# EAGLE design Martin-V-USB_Mame_Panel_Atmega8ISP-V20f (EAGLE 6.3)
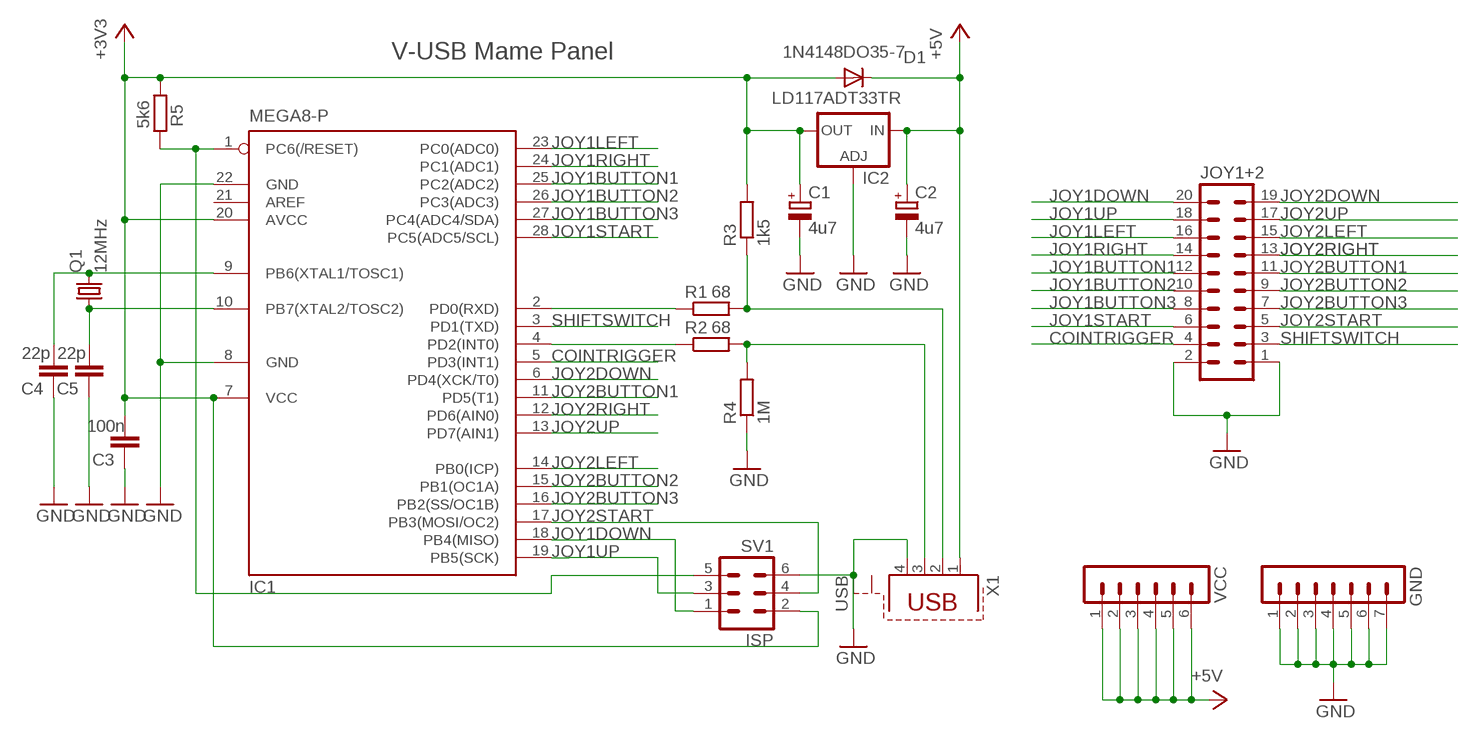
[diagram p0: schematic, sheet 1]

## Parts
C1  4u7  CPOL-EUE2.5-5  [E2,5-5]
C2  4u7  CPOL-EUE2.5-5  [E2,5-5]
C3  100n  C-EU050-030X075  [C050-030X075]
C4  22p  C-EU025-025X050  [C025-025X050]
C5  22p  C-EU025-025X050  [C025-025X050]
D1  1N4148DO35-7  [DO35-7]
GND  MA07-1  [MA07-1]
IC1  MEGA8-P  [DIL28-3]
IC2  LD117ADT33TR  [DPACK]
JOY1+2  MA10-2W  [MA10-2W]
Q1  12MHz  CRYSTALHC18U-V  [HC18U-V]
R1  68  R-EU_0207/10  [0207/10]
R2  68  R-EU_0207/10  [0207/10]
R3  1k5  R-EU_0207/10  [0207/10]
R4  1M  R-EU_0207/10  [0207/10]
R5  5k6  R-EU_0207/10  [0207/10]
SV1  ISP  ML6  [ML6]
VCC  MA06-1  [MA06-1]
X1  USB  PN61729-S  [PN61729-S]

## Nets
+3V3 [power]: C1.+ C3.2 D1.A IC1.7(VCC) IC1.20(AVCC) IC2.4(OUT) R3.2 R5.1 SV1.2
+5V [power]: C2.+ D1.C IC2.3(IN) VCC.1 VCC.2 VCC.3 VCC.4 VCC.5 VCC.6 X1.1
COINTRIGGER: IC1.5(PD3(INT1)) JOY1+2.4
GND [power]: C1.- C2.- C3.1 C4.1 C5.1 GND.1 GND.2 GND.3 GND.4 GND.5 GND.6 GND.7 IC1.8(GND) IC1.22(GND) IC2.1(ADJ) JOY1+2.1 JOY1+2.2 R4.1 SV1.6 X1.4
JOY1BUTTON1: IC1.25(PC2(ADC2)) JOY1+2.12
JOY1BUTTON2: IC1.26(PC3(ADC3)) JOY1+2.10
JOY1BUTTON3: IC1.27(PC4(ADC4/SDA)) JOY1+2.8
JOY1DOWN: IC1.18(PB4(MISO)) JOY1+2.20 SV1.1
JOY1LEFT: IC1.23(PC0(ADC0)) JOY1+2.16
JOY1RIGHT: IC1.24(PC1(ADC1)) JOY1+2.14
JOY1START: IC1.28(PC5(ADC5/SCL)) JOY1+2.6
JOY1UP: IC1.19(PB5(SCK)) JOY1+2.18 SV1.3
JOY2BUTTON1: IC1.11(PD5(T1)) JOY1+2.11
JOY2BUTTON2: IC1.15(PB1(OC1A)) JOY1+2.9
JOY2BUTTON3: IC1.16(PB2(SS/OC1B)) JOY1+2.7
JOY2DOWN: IC1.6(PD4(XCK/T0)) JOY1+2.19
JOY2LEFT: IC1.14(PB0(ICP)) JOY1+2.15
JOY2RIGHT: IC1.12(PD6(AIN0)) JOY1+2.13
JOY2START: IC1.17(PB3(MOSI/OC2)) JOY1+2.5 SV1.4
JOY2UP: IC1.13(PD7(AIN1)) JOY1+2.17
N$1: IC1.2(PD0(RXD)) R1.1
N$2: IC1.4(PD2(INT0)) R2.1
N$3: IC1.1(PC6(/RESET)) R5.2 SV1.5
N$4: R1.2 R3.1 X1.2
N$5: R2.2 R4.2 X1.3
N$10: C4.2 IC1.9(PB6(XTAL1/TOSC1)) Q1.2
N$11: C5.2 IC1.10(PB7(XTAL2/TOSC2)) Q1.1
SHIFTSWITCH: IC1.3(PD1(TXD)) JOY1+2.3
Unconnected: IC1.21(AREF) X1.S1 X1.S2

## Notes on the sheet
- V-USB Mame Panel

## Library data of the parts
C1 C2 = rcl:CPOL-EU: POLARIZED CAPACITOR, European symbol
C3-C5 = resistor:C-EU: CAPACITOR, European symbol
D1 = diode:1N4148: DIODE high speed (Philips)
GND = con-lstb:MA07-1: PIN HEADER; OC_FARNELL: unknown; OC_NEWARK: unknown
IC1 = atmel:MEGA8-P: MICROCONTROLLER 8 Kbytes FLASH, 1 kbytes SRAM, 512 bytes EEPROM, USART, 4-channel 10 bit ADC, 2-channel 8 bit ADC Pin compatible with Atmega48, ATMega88, ATMega168 Source: avr.lbr
IC2 = v-reg:LD117A?*: Low drop fixed and adjustable positive voltage regulators 1 A Source: http://www.st.com/stonline/products/literature/ds/7194/ld1117axx.pdf
JOY1+2 = con-lstb:MA10-2W: PIN HEADER; OC_FARNELL: unknown; OC_NEWARK: unknown
Q1 = crystal:CRYSTAL: CRYSTAL
R1 R3-R5 = resistor:R-EU_: RESISTOR, European symbol
R2 = rcl:R-EU_: RESISTOR, European symbol
SV1 = con-harting-ml:ML6: HARTING
VCC = con-lstb:MA06-1: PIN HEADER; OC_FARNELL: unknown; OC_NEWARK: unknown
X1 = con-berg:PN61729-S: BERG USB connector; OC_FARNELL: unknown; OC_NEWARK: unknown

## Net classes
0 default: width 0.254 mm
1 power: width 0.813 mm

## Board
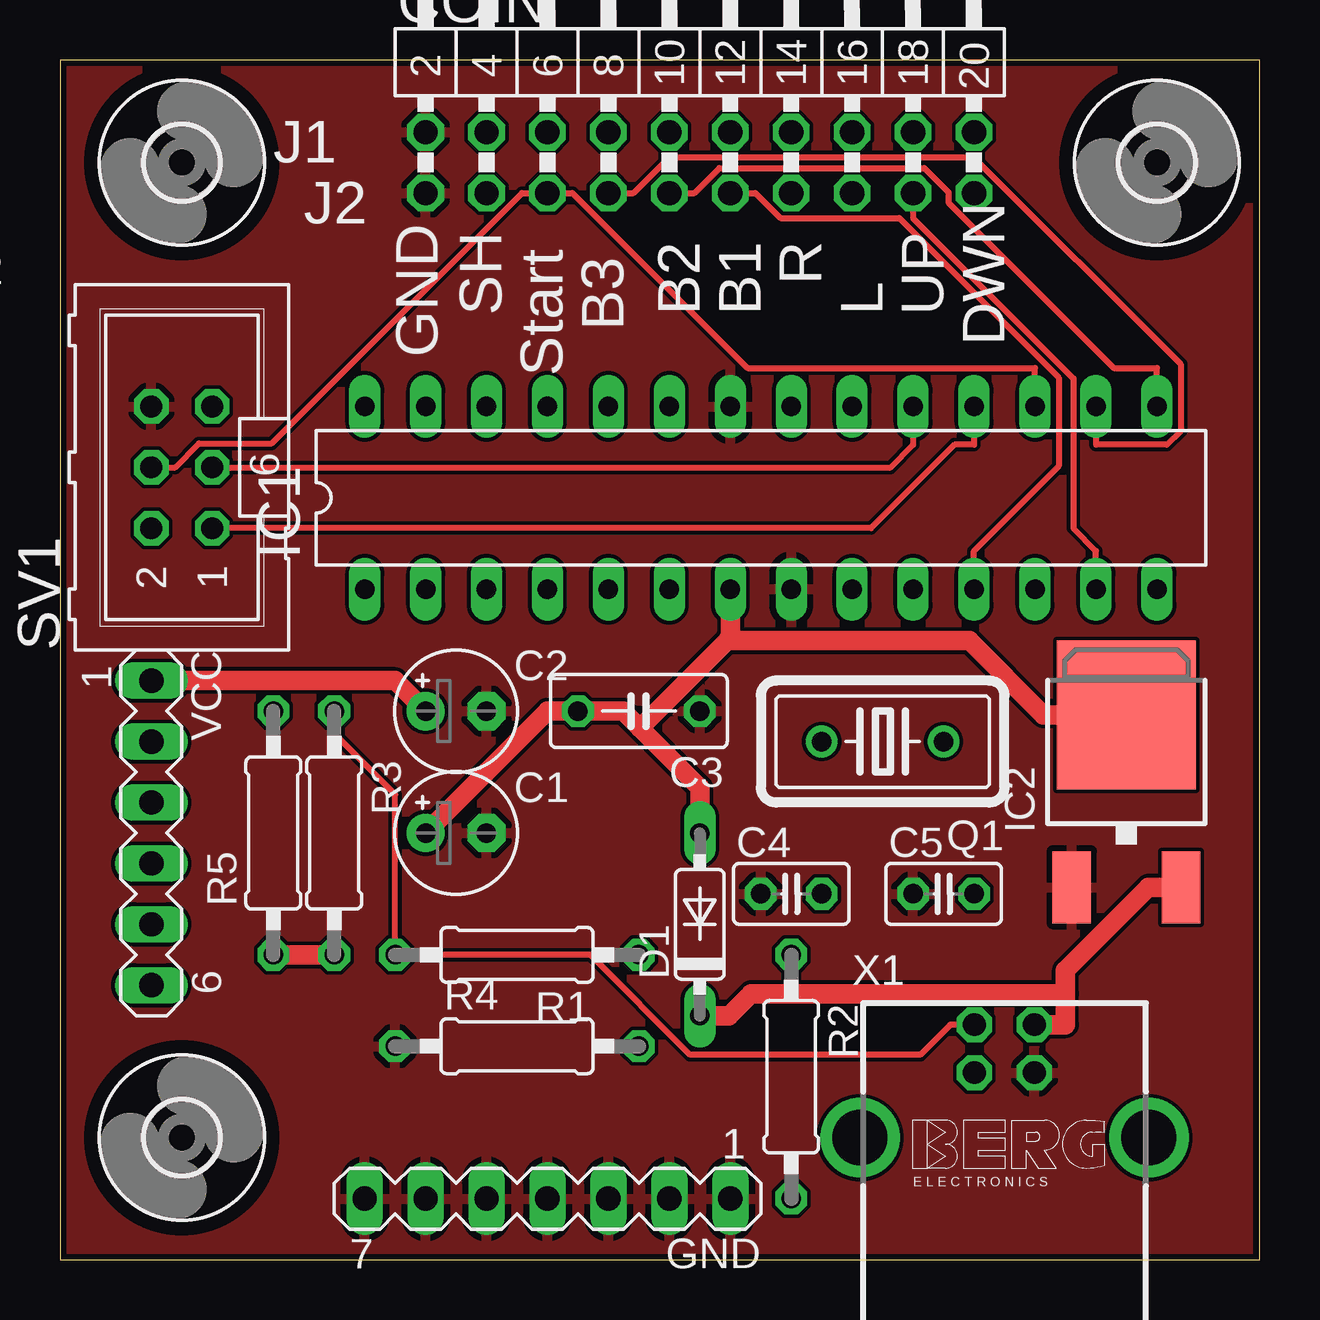
[diagram p1: board, top side]
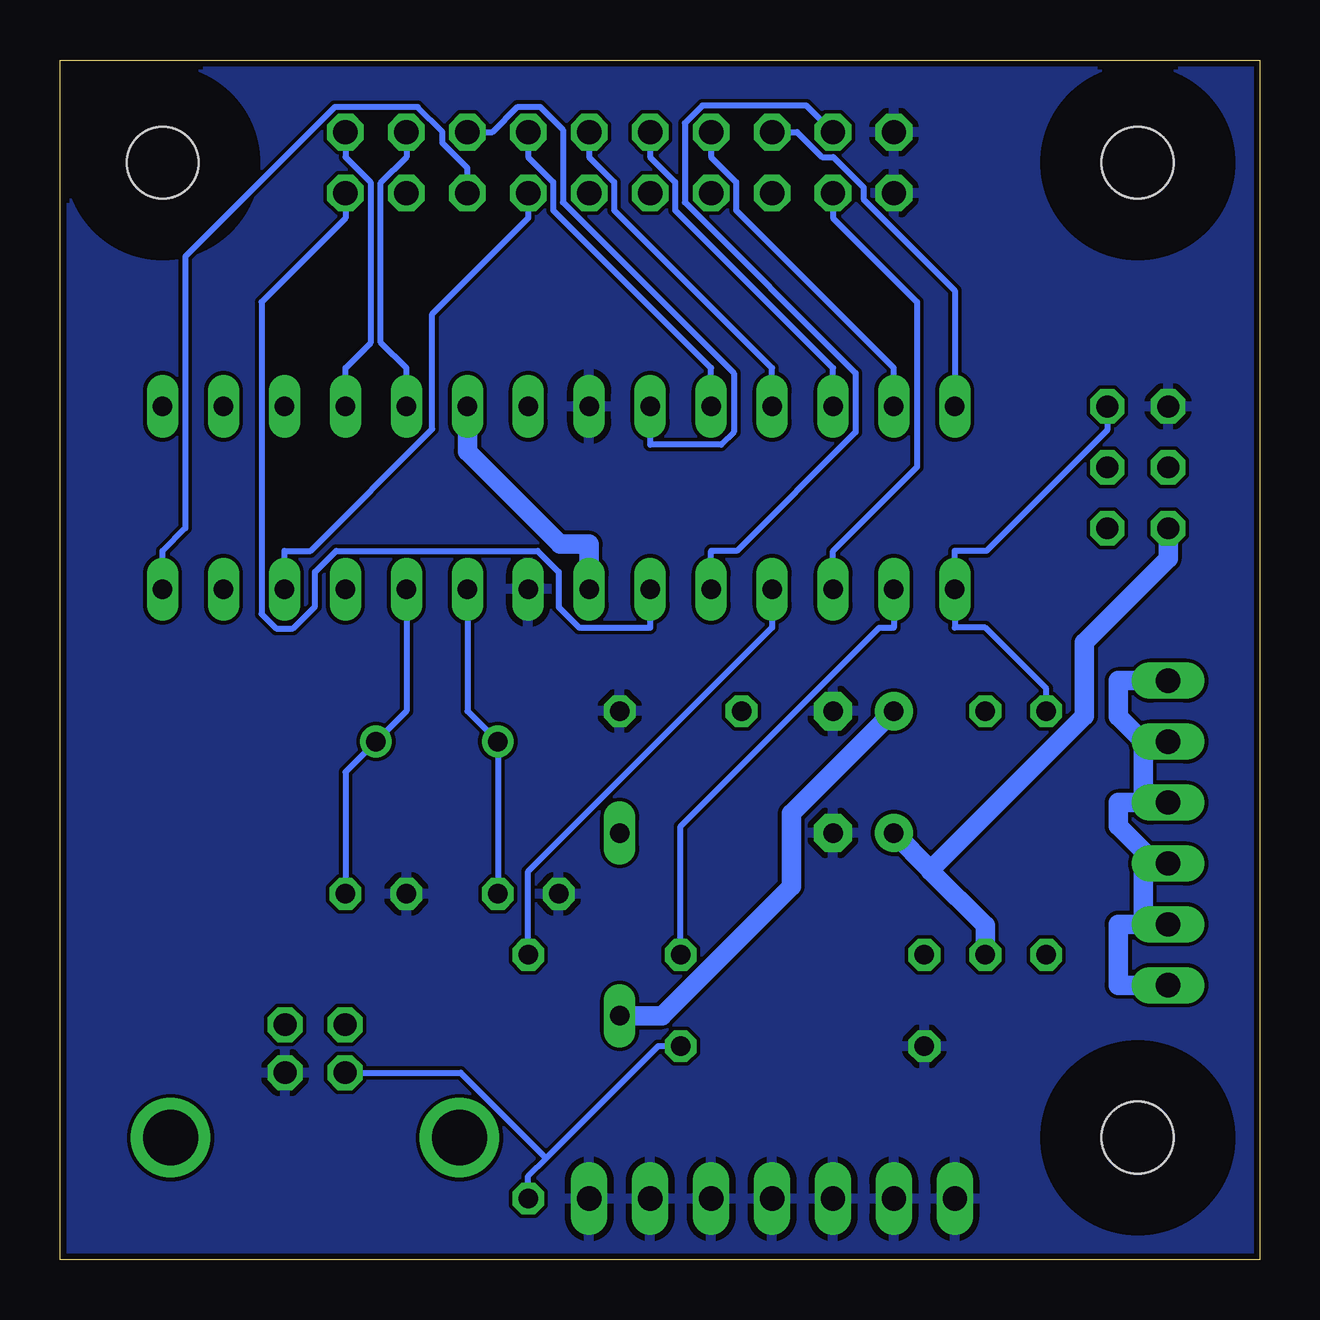
[diagram p2: board, bottom side, seen from below]

Size 50 x 50 mm. Coordinates in mm from the lower left corner, seen from the top.
Outline: 0,0 50,0 50,50 0,50 0,0
Copper layers (1*16): Top 0.035mm / dielectric 1.5mm / Bottom 0.035mm
Design rules "Elecrow_2-layer_eagle_rule": minimum track width 6mil, minimum drill 12mil, track to track 6mil, track to pad 6mil, pad to pad 6mil, via to via 6mil, smd to smd 0mil, copper to edge 10mil, drill to drill 10mil, minimum pad ring 10mil, minimum via ring 6mil, stop-mask expansion 2mil, vias tented up to drill 100mil, thermal gap 10mil

### Footprints (pad centres in the part's own frame; a part is rotated, then mirrored left to right if it is on the bottom)
E2,5-5 = drill 0.813 pad 1.6: + -1.27,0 | drill 0.813 pad 1.6 octagon: - 1.27,0
C050-030X075 = drill 0.813 octagon: 1 -2.54,0; 2 2.54,0
C025-025X050 = drill 0.813 octagon: 1 -1.27,0; 2 1.27,0
DO35-7 = drill 0.813 long: A 3.81,0; C -3.81,0
MA07-1 = drill 1.016 long: 1 -7.62,0; 2 -5.08,0; 3 -2.54,0; 4 0,0; 5 2.54,0; 6 5.08,0; 7 7.62,0
DIL28-3 = drill 0.813 long: 1 -16.51,-3.81; 2 -13.97,-3.81; 3 -11.43,-3.81; 4 -8.89,-3.81; 5 -6.35,-3.81; 6 -3.81,-3.81; 7 -1.27,-3.81; 8 1.27,-3.81; 9 3.81,-3.81; 10 6.35,-3.81; 11 8.89,-3.81; 12 11.43,-3.81; 13 13.97,-3.81; 14 16.51,-3.81; 15 16.51,3.81; 16 13.97,3.81; 17 11.43,3.81; 18 8.89,3.81; 19 6.35,3.81; 20 3.81,3.81; 21 1.27,3.81; 22 -1.27,3.81; 23 -3.81,3.81; 24 -6.35,3.81; 25 -8.89,3.81; 26 -11.43,3.81; 27 -13.97,3.81; 28 -16.51,3.81
DPACK = smd 1.6 x 3: 1 -2.28,-4.8; 3 2.28,-4.8 | smd 5.8 x 6.2: 4 0,2.38
MA10-2W = drill 1.016 octagon: 1 -11.43,-1.27; 2 -11.43,1.27; 3 -8.89,-1.27; 4 -8.89,1.27; 5 -6.35,-1.27; 6 -6.35,1.27; 7 -3.81,-1.27; 8 -3.81,1.27; 9 -1.27,-1.27; 10 -1.27,1.27; 11 1.27,-1.27; 12 1.27,1.27; 13 3.81,-1.27; 14 3.81,1.27; 15 6.35,-1.27; 16 6.35,1.27; 17 8.89,-1.27; 18 8.89,1.27; 19 11.43,-1.27; 20 11.43,1.27
HC18U-V = drill 0.813: 1 -2.54,0; 2 2.54,0
0207/10 = drill 0.813 octagon: 1 -5.08,0; 2 5.08,0
ML6 = drill 0.914 octagon: 1 -2.54,-1.27; 2 -2.54,1.27; 3 0,-1.27; 4 0,1.27; 5 2.54,-1.27; 6 2.54,1.27
3,0 = hole 3: 0,0
MA06-1 = drill 1.016 long: 1 -6.35,0; 2 -3.81,0; 3 -1.27,0; 4 1.27,0; 5 3.81,0; 6 6.35,0
PN61729-S = drill 0.95 octagon: 1 1.25,4.71; 2 -1.25,4.71; 3 -1.25,2.71; 4 1.25,2.71 | drill 2.3 pad 2.9: S1 -6.02,0; S2 6.02,0

### Placement (x,y rotation side)
C1  16.51,17.78 0 top
C2  16.51,22.86 0 top
C3  24.13,22.86 180 top
C4  30.48,15.24 0 top
C5  36.83,15.24 0 top
D1  26.67,13.97 90 top
GND  20.32,2.54 180 top
IC1  29.21,31.75 0 top
IC2  44.45,20.32 0 top
JOY1+2  26.67,45.72 0 top
Q1  34.29,21.59 180 top
R1  19.05,12.7 180 top
R2  30.48,7.62 270 top
R3  11.43,17.78 270 top
R4  19.05,8.89 0 top
R5  8.89,17.78 90 top
SV1  5.08,33.02 90 top
U$1  [3,0]  5.08,5.08 0 top
U$2  [3,0]  45.72,45.72 0 top
U$3  [3,0]  5.08,45.72 0 top
VCC  3.81,17.78 270 top
X1  39.37,5.08 0 top

### Tracks (layer width: path | path; a pad name or v marks a point on that pad's centre or on a via)
+3V3
  Top 0.813: 24.18,22.15 27.82,25.79 27.94,25.79 | 24.18,22.15 23.47,22.86 C3.2 20.32,22.86 C1.+ | 24.18,22.15 26.67,19.66 D1.A | 27.94,25.79 37.9,25.79 40.99,22.7 IC2.4 | 27.94,25.79 27.94,26.06 IC1.7 | R5.1 R3.2
  Bottom 0.813: IC1.7 27.94,29.82 29.16,29.82 33.02,33.68 IC1.20 | 13.71,16.25 C1.+ | 13.71,16.25 13.71,16.2 11.43,13.92 R3.2 | 13.71,16.25 7.3,22.66 7.3,25.72 3.81,29.21 SV1.2
+5V
  Top 0.813: C2.+ 13.97,24.13 VCC.1 | 41.91,11.08 41.91,12.06 45.37,15.52 IC2.3 | 41.91,11.08 41.91,9.79 X1.1 | 41.91,11.08 28.81,11.08 27.89,10.16 D1.C
  Bottom 0.813: D1.C 24.91,10.16 19.51,15.56 19.51,18.59 C2.+ | 4.85,19.05 5.89,19.05 5.89,18.07 4.33,16.51 | VCC.3 4.85,19.05 | 4.85,19.05 4.85,21.59 | 4.33,16.51 4.85,16.51 4.85,13.97 | VCC.4 4.33,16.51 | 4.85,13.97 5.89,13.97 5.89,11.43 VCC.6 | VCC.5 4.85,13.97 | VCC.1 5.89,24.13 5.89,22.63 4.85,21.59 | VCC.2 4.85,21.59
COINTRIGGER
  Bottom 0.254: IC1.5 22.86,29.54 21.78,29.54 16.84,34.48 16.84,36.95 23.95,44.07 23.95,47.38 23.23,48.1 18.89,48.1 JOY1+2.4
GND
  pour Bottom: 0,0 0,49.53 49.53,49.53 49.53,0
  pour Top: 0,49.53 0,0 49.53,0 49.53,49.53
  pour Bottom: 0,0 0,49.53 49.53,49.53 49.53,0
JOY1BUTTON1
  Bottom 0.254: IC1.25 20.32,37.16 26.9,43.74 26.9,44.91 27.94,45.95 JOY1+2.12
JOY1BUTTON2
  Bottom 0.254: IC1.26 17.78,37.16 24.36,43.74 24.36,44.91 25.4,45.95 JOY1+2.10
JOY1BUTTON3
  Bottom 0.254: IC1.27 15.24,37.16 21.82,43.74 21.82,44.91 22.86,45.95 JOY1+2.8
JOY1DOWN
  Top 0.254: SV1.1 33.81,30.48 37.29,33.96 38.1,33.96 IC1.18
  Bottom 0.254: IC1.18 38.1,37.16 37.06,38.2 37.06,44.91 38.1,45.95 JOY1+2.20
JOY1LEFT
  Bottom 0.254: IC1.23 25.4,33.96 22.44,33.96 21.91,34.49 21.91,36.95 29.03,44.07 29.03,47.09 29.99,48.04 30.93,48.04 31.98,46.99 JOY1+2.16
JOY1RIGHT
  Bottom 0.254: IC1.24 22.86,37.16 29.44,43.74 29.44,44.91 30.48,45.95 JOY1+2.14
JOY1START
  Bottom 0.254: JOY1+2.6 19.28,46.99 18.24,45.95 17.77,45.95 16.51,44.69 16.51,44.2 12.7,40.4 IC1.28
JOY1UP
  Top 0.254: IC1.19 35.56,33.96 34.62,33.02 SV1.3
  Bottom 0.254: JOY1+2.18 35.56,45.95 36.63,44.88 36.63,38.23 35.56,37.16 IC1.19
JOY2BUTTON1
  Top 0.254: IC1.11 38.1,29.54 41.63,33.08 41.63,36.76 34.98,43.41 30.02,43.41 28.98,44.45 JOY1+2.11
JOY2BUTTON2
  Top 0.254: IC1.15 45.72,37.16 43.92,37.16 37.03,44.04 37.03,44.49 36.03,45.49 27.48,45.49 26.44,44.45 JOY1+2.9
JOY2BUTTON3
  Top 0.254: IC1.16 43.18,33.96 46.13,33.96 46.71,34.54 46.71,37.32 38.08,45.95 25.4,45.95 23.9,44.45 JOY1+2.7
JOY2DOWN
  Bottom 0.254: IC1.6 25.4,26.34 28.36,26.34 29.21,27.19 29.21,28.66 30.09,29.54 38.49,29.54 39.37,28.66 39.37,27.22 40.28,26.31 41,26.31 41.6,26.91 41.6,39.91 38.1,43.41 JOY1+2.19
JOY2LEFT
  Bottom 0.254: IC1.14 45.72,29.54 44.78,30.48 44.78,41.8 38.55,48.03 35.09,48.03 34.06,47 34.06,46.53 33.02,45.49 JOY1+2.15
JOY2RIGHT
  Bottom 0.254: IC1.12 40.64,29.54 39.56,29.54 34.48,34.62 34.48,39.41 30.48,43.41 JOY1+2.13
JOY2START
  Top 0.254: IC1.17 40.64,37.16 28.65,37.16 21.36,44.45 JOY1+2.5 19.25,44.45 8.81,34.01 5.79,34.01 4.8,33.02 SV1.4
JOY2UP
  Top 0.254: IC1.13 43.18,29.54 42.24,30.48 42.24,36.73 35.56,43.41 JOY1+2.17
N$1
  Bottom 0.254: IC1.2 15.24,26.34 15.85,26.34 24.13,18.06 R1.1
N$2
  Bottom 0.254: IC1.4 20.32,26.34 30.48,16.18 R2.1
N$3
  Bottom 0.254: SV1.5 6.35,34.57 11.38,29.54 12.7,29.54 IC1.1 12.7,26.34 11.43,26.34 8.89,23.8 R5.2
N$4
  Top 0.254: R3.1 11.43,21.92 13.97,19.38 R1.2 22.11,12.7 26.27,8.54 35.86,8.54 37.11,9.79 X1.2
N$5
  Bottom 0.254: 29.73,4.22 30.48,3.48 R2.2 | 29.73,4.22 25.07,8.89 R4.2 | X1.3 33.3,7.79 29.73,4.22
N$10
  Bottom 0.254: IC1.9 33.02,22.86 Q1.2 C4.2
N$11
  Bottom 0.254: C5.2 38.1,20.32 Q1.1 35.56,22.86 IC1.10
SHIFTSWITCH
  Bottom 0.254: IC1.3 17.78,29.54 14.28,33.04 14.28,39.91 17.78,43.41 JOY1+2.3

### Text on the board
tNames: COIN | J1 | J2 | GND | R | SH | B3 | B2 | B1 | L | UP | DWN | Start